# Altium schematic sheet lpc11c14.SchDoc
size A4; Organization: UNSW Solar Racing Team; Address3: UNSW; Address4: Sydney NSW 2052; Address2: Electrical Engineering; Address1: Rm 109
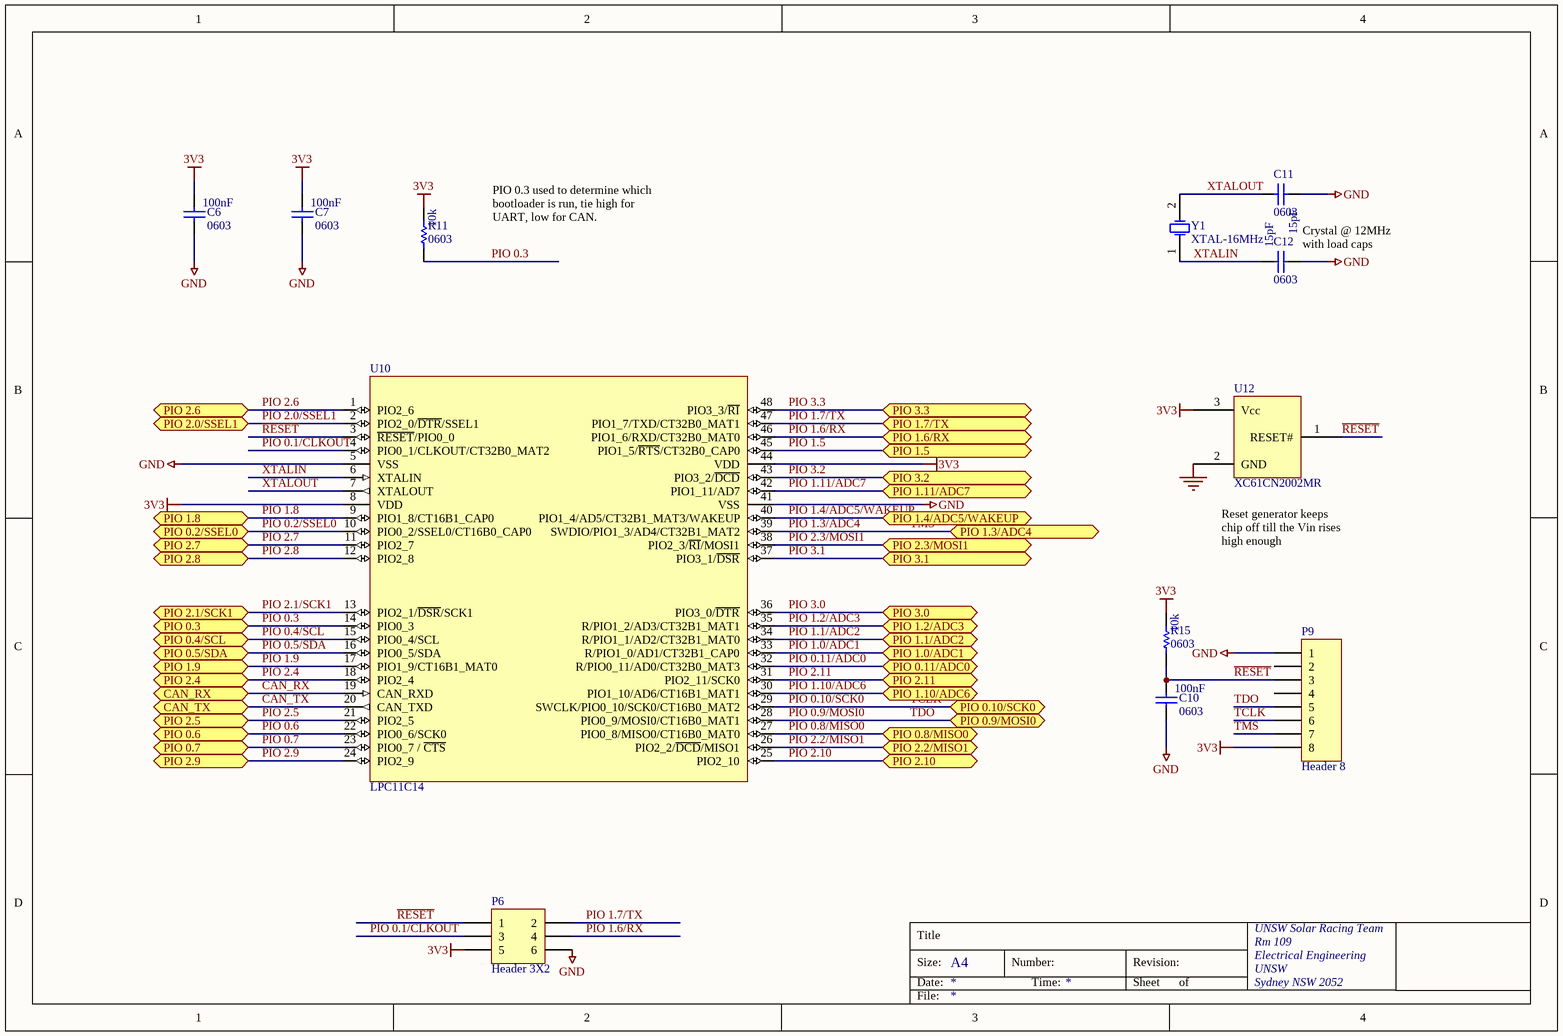
[diagram p0: lpc11c14.SchDoc]

## Parts
C6  value 100nF  package: 0603  [0603_M]  (hidden comment: C)
C7  value 100nF  package: 0603  [0603_M]  (hidden comment: C)
C10  value 100nF  package: 0603  [0603_M]  (hidden comment: C)
C11  value 15pF  package: 0603  [0603_M]  (hidden comment: C)
C12  value 15pF  package: 0603  [0603_M]  (hidden comment: C)
P6  Header 3X2  [HDR2X3]
P9  Header 8  [HDR1X8]
R11  value 10k  package: 0603  [0603_M]  (hidden comment: R)
R15  value 10k  package: 0603  [0603_M]  (hidden comment: R)
U10  LPC11C14  [QFP48]
U12  XC61CN2002MR  [SOT23-3]
Y1  XTAL-16MHz  [XTAL_TH_4.88MM]

## Ports
CAN_RX, CAN_TX, PIO 0.2/SSEL0, PIO 0.3, PIO 0.4/SCL, PIO 0.5/SDA, PIO 0.6, PIO 0.7, PIO 0.8/MISO0, PIO 0.9/MOSI0, PIO 0.10/SCK0, PIO 0.11/ADC0, PIO 1.0/ADC1, PIO 1.1/ADC2, PIO 1.2/ADC3, PIO 1.3/ADC4, PIO 1.4/ADC5/WAKEUP, PIO 1.5, PIO 1.6/RX, PIO 1.7/TX, PIO 1.8, PIO 1.9, PIO 1.10/ADC6, PIO 1.11/ADC7, PIO 2.0/SSEL1, PIO 2.1/SCK1, PIO 2.2/MISO1, PIO 2.3/MOSI1, PIO 2.4, PIO 2.5, PIO 2.6, PIO 2.7, PIO 2.8, PIO 2.9, PIO 2.10, PIO 2.11, PIO 3.0, PIO 3.1, PIO 3.2, PIO 3.3

## Nets
3V3: C6.1 C7.1 P6.5 P9.8 R11.2 R15.2 U10.8(VDD) U10.44(VDD) U12.3(Vcc)
GND: C6.2 C7.2 C10.2 C11.1 C12.2 P6.6 P9.1 U10.5(VSS) U10.41(VSS) U12.2(GND)
CAN_RX: U10.19(CAN_RXD) ; port CAN_RX
CAN_TX: U10.20(CAN_TXD) ; port CAN_TX
PIO 0.1/CLKOUT: P6.3 U10.4(PIO0_1/CLKOUT/CT32B0_MAT2)
PIO 0.2/SSEL0: U10.10(PIO0_2/SSEL0/CT16B0_CAP0) ; port PIO 0.2/SSEL0
PIO 0.3: R11.1 U10.14(PIO0_3) ; port PIO 0.3
PIO 0.4/SCL: U10.15(PIO0_4/SCL) ; port PIO 0.4/SCL
PIO 0.5/SDA: U10.16(PIO0_5/SDA) ; port PIO 0.5/SDA
PIO 0.6: U10.22(PIO0_6/SCK0) ; port PIO 0.6
PIO 0.7: U10.23(PIO0_7_/_~{CTS}) ; port PIO 0.7
PIO 0.8/MISO0: U10.27(PIO0_8/MISO0/CT16B0_MAT0) ; port PIO 0.8/MISO0
PIO 0.9/MOSI0: P9.5 U10.28(PIO0_9/MOSI0/CT16B0_MAT1) ; port PIO 0.9/MOSI0  [also labelled TDO]
PIO 0.10/SCK0: P9.6 U10.29(SWCLK/PIO0_10/SCK0/CT16B0_MAT2) ; port PIO 0.10/SCK0  [also labelled TCLK]
PIO 0.11/ADC0: U10.32(R/PIO0_11/AD0/CT32B0_MAT3) ; port PIO 0.11/ADC0
PIO 1.0/ADC1: U10.33(R/PIO1_0/AD1/CT32B1_CAP0) ; port PIO 1.0/ADC1
PIO 1.1/ADC2: U10.34(R/PIO1_1/AD2/CT32B1_MAT0) ; port PIO 1.1/ADC2
PIO 1.2/ADC3: U10.35(R/PIO1_2/AD3/CT32B1_MAT1) ; port PIO 1.2/ADC3
PIO 1.3/ADC4: P9.7 U10.39(SWDIO/PIO1_3/AD4/CT32B1_MAT2) ; port PIO 1.3/ADC4  [also labelled TMS]
PIO 1.4/ADC5/WAKEUP: U10.40(PIO1_4/AD5/CT32B1_MAT3/WAKEUP) ; port PIO 1.4/ADC5/WAKEUP
PIO 1.5: U10.45(PIO1_5/~{RTS}/CT32B0_CAP0) ; port PIO 1.5
PIO 1.6/RX: P6.4 U10.46(PIO1_6/RXD/CT32B0_MAT0) ; port PIO 1.6/RX
PIO 1.7/TX: P6.2 U10.47(PIO1_7/TXD/CT32B0_MAT1) ; port PIO 1.7/TX
PIO 1.8: U10.9(PIO1_8/CT16B1_CAP0) ; port PIO 1.8
PIO 1.9: U10.17(PIO1_9/CT16B1_MAT0) ; port PIO 1.9
PIO 1.10/ADC6: U10.30(PIO1_10/AD6/CT16B1_MAT1) ; port PIO 1.10/ADC6
PIO 1.11/ADC7: U10.42(PIO1_11/AD7) ; port PIO 1.11/ADC7
PIO 2.0/SSEL1: U10.2(PIO2_0/~{DTR}/SSEL1) ; port PIO 2.0/SSEL1
PIO 2.1/SCK1: U10.13(PIO2_1/~{DSR}/SCK1) ; port PIO 2.1/SCK1
PIO 2.2/MISO1: U10.26(PIO2_2/~{DCD}/MISO1) ; port PIO 2.2/MISO1
PIO 2.3/MOSI1: U10.38(PIO2_3/~{RI}/MOSI1) ; port PIO 2.3/MOSI1
PIO 2.4: U10.18(PIO2_4) ; port PIO 2.4
PIO 2.5: U10.21(PIO2_5) ; port PIO 2.5
PIO 2.6: U10.1(PIO2_6) ; port PIO 2.6
PIO 2.7: U10.11(PIO2_7) ; port PIO 2.7
PIO 2.8: U10.12(PIO2_8) ; port PIO 2.8
PIO 2.9: U10.24(PIO2_9) ; port PIO 2.9
PIO 2.10: U10.25(PIO2_10) ; port PIO 2.10
PIO 2.11: U10.31(PIO2_11/SCK0) ; port PIO 2.11
PIO 3.0: U10.36(PIO3_0/~{DTR}) ; port PIO 3.0
PIO 3.1: U10.37(PIO3_1/~{DSR}) ; port PIO 3.1
PIO 3.2: U10.43(PIO3_2/~{DCD}) ; port PIO 3.2
PIO 3.3: U10.48(PIO3_3/~{RI}) ; port PIO 3.3
~{RESET}: C10.1 P6.1 P9.3 R15.1 U10.3(~{RESET}/PIO0_0) U12.1(RESET#)
XTALIN: C12.1 U10.6(XTALIN) Y1.1(OSC1)
XTALOUT: C11.2 U10.7(XTALOUT) Y1.2(OSC2)

Not connected (* = marked no-connect by the designer): P9 2 4

## Notes on the sheet
- PIO 0.3 used to determine which bootloader is run, tie high for UART, low for CAN.
- Crystal @ 12MHz with load caps
- (near U12) Reset generator keeps chip off till the Vin rises high enough
- Text
- Title
- Size:
- Date:
- A4
- Number:
- Time:
- Revision:
- Sheet
- of
- File:

## Library data of the parts
C6 C7 C10-C12 = C: Default Capacitor; Supplier: Digikey
P6 = Header 3X2: Header, 3-Pin, Dual row; LatestRevisionDate: 17-Jul-2002; LatestRevisionNote: Re-released for DXP Platform.; Publisher: Altium Limited
P9 = Header 8: Header, 8-Pin; LatestRevisionDate: 17-Jul-2002; LatestRevisionNote: Re-released for DXP Platform.; Publisher: Altium Limited
R11 R15 = R: Resistor; Supplier 1: Digikey
U10 = LPC11C14_Full: NXP LPC11C14 Microcontroller; Farnell: NA
U12 = XC61F: SOT23 reset generator; Needed?: Farnell; Farnell: 3605486; Farnell Price: 1.74
Y1 = XTAL-16MHz: Crystal Oscillator; Manufacturer: NDK; Manufacturer Part Number: NX5032GA-16.000000MHZ-LN-CD-1; Frequency: 16MHz; Frequency Stability: ±50ppm; Load Capacitance: 8pF; ESR (Equivalent Series Resistance): 120 Ohm; Operating Mode: Fundamental; Published: 8-Jun-2000; LatestRevisionDate: 17-Jul-2002; LatestRevisionNote: Re-released for DXP Platform.; PackageReference: R38; Publisher: Altium Limited; PackageDescription: Crystal, Thru-Hole; 2 Leads; Body 3.1 x 8.2 mm (Dia.xH); Supplier 1: Digi-Key; RoHS: RoHS Compliant; Category: Crystals and Oscillators; Stock 1: 27087; Pricing 1: 1=0.81, 10=0.702, 50=0.6156, 100=0.486, 500=0.4104 (USD); Type: MHz Crystal; Frequency Tolerance: ±50ppm; Operating Temperature: -10°C ~ 70°C; Ratings: -; Mounting Type: Surface Mount; Package / Case: 2-SMD; Size / Dimension: 0.197" L x 0.126" W (5.00mm x 3.20mm); Height: 0.059" (1.50mm); Packaging: Cut Tape (CT); ComponentLink1URL: http://media.digikey.com/pdf/Data%20Sheets/NDK%20PDFs/NX5032GA.pdf; ComponentLink1Description: http://media.digikey.com/pdf/Data%20Sheets/NDK%20PDFs/NX5032GA.pdf; Supplier Part Number 1: 644-1037-1-ND